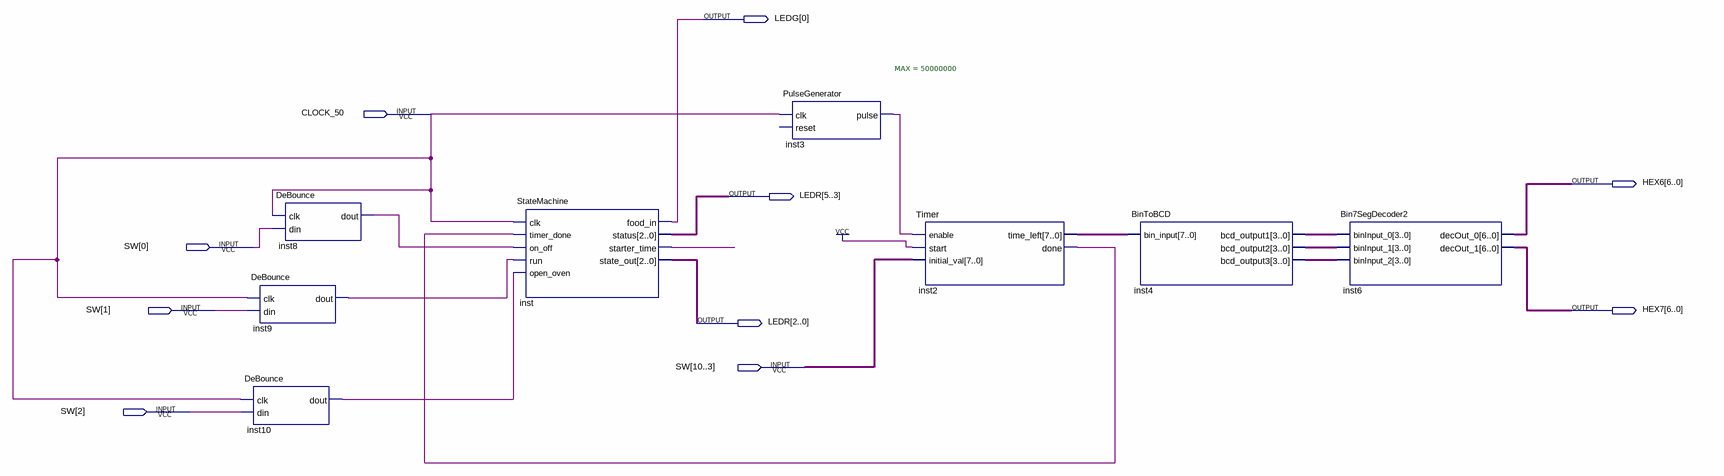
[diagram p0: schematic sheet]
// Quartus schematic StateMachineToTimer.bdf as structural Verilog: 8 symbols, 10 pins
module StateMachineToTimer (
  input  CLOCK_50,
  input  [10:0] SW,
  output [0:0] LEDG,
  output [6:0] HEX6,
  output [5:0] LEDR,
  output [6:0] HEX7
);

  wire inst2_done, inst3_pulse, inst8_dout, inst9_dout, inst10_dout, inst_starter_time;
  wire [3:0] inst4_bcd_output1, inst4_bcd_output2, inst4_bcd_output3;
  wire [7:0] inst2_time_left;

  DeBounce inst9 (.clk(CLOCK_50), .din(SW[1]), .dout(inst9_dout));
  DeBounce inst10 (.clk(CLOCK_50), .din(SW[2]), .dout(inst10_dout));
  DeBounce inst8 (.clk(CLOCK_50), .din(SW[0]), .dout(inst8_dout));
  StateMachine inst (
    .clk(CLOCK_50), .timer_done(inst2_done), .on_off(inst8_dout), .run(inst9_dout), .open_oven(inst10_dout),
    .food_in(LEDG[0]), .status(LEDR[5:3]), .starter_time(inst_starter_time), .state_out(LEDR[2:0]));
  PulseGenerator #(.MAX(50000000)) inst3 (.clk(CLOCK_50), .pulse(inst3_pulse));  // open: reset
  Timer inst2 (
    .enable(inst3_pulse), .start(1'b1), .initial_val(SW[10:3]), .time_left(inst2_time_left), .done(inst2_done));
  BinToBCD inst4 (
    .bin_input(inst2_time_left), .bcd_output1(inst4_bcd_output1), .bcd_output2(inst4_bcd_output2),
    .bcd_output3(inst4_bcd_output3));
  Bin7SegDecoder2 inst6 (
    .binInput_0(inst4_bcd_output1), .binInput_1(inst4_bcd_output2), .binInput_2(inst4_bcd_output3),
    .decOut_0(HEX6), .decOut_1(HEX7));
endmodule
